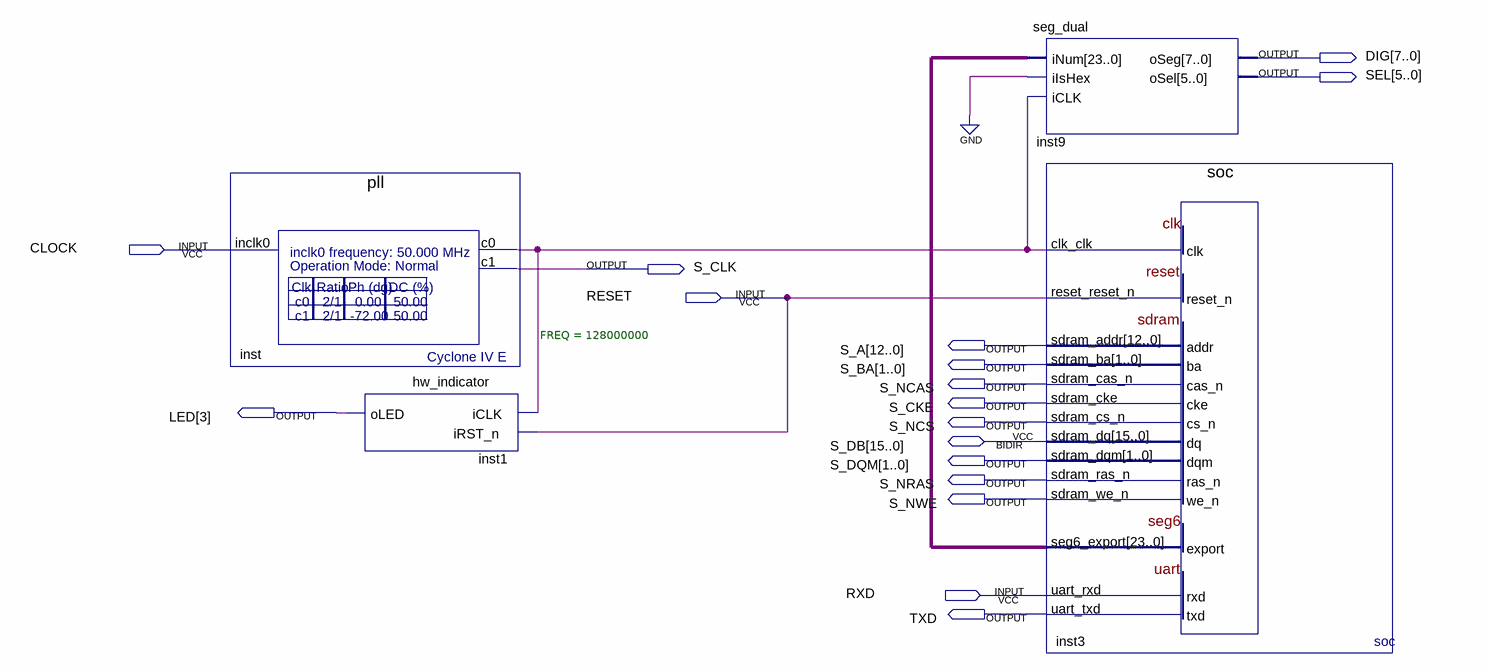
[diagram p0: schematic sheet]
// Quartus schematic top.bdf as structural Verilog: 4 symbols, 17 pins
module top (
  input  CLOCK,
  input  RESET,
  input  RXD,
  inout  [15:0] S_DB,
  output [7:0] DIG,
  output [5:0] SEL,
  output S_CLK,
  output [12:0] S_A,
  output [1:0] S_BA,
  output S_NCAS,
  output S_CKE,
  output [3:3] LED,
  output S_NCS,
  output [1:0] S_DQM,
  output S_NRAS,
  output S_NWE,
  output TXD
);

  wire inst_c0;
  wire [23:0] inst3_seg6_export;

  pll inst (.inclk0(CLOCK), .c0(inst_c0), .c1(S_CLK));
  hw_indicator #(.FREQ(128000000)) inst1 (.iCLK(inst_c0), .iRST_n(RESET), .oLED(LED[3]));
  seg_dual inst9 (.iNum(inst3_seg6_export), .iIsHex(1'b0), .iCLK(inst_c0), .oSeg(DIG), .oSel(SEL));
  soc inst3 (
    .clk_clk(inst_c0), .reset_reset_n(RESET), .uart_rxd(RXD), .sdram_addr(S_A), .sdram_ba(S_BA),
    .sdram_cas_n(S_NCAS), .sdram_cke(S_CKE), .sdram_cs_n(S_NCS), .sdram_dqm(S_DQM), .sdram_ras_n(S_NRAS),
    .sdram_we_n(S_NWE), .seg6_export(inst3_seg6_export), .uart_txd(TXD), .sdram_dq(S_DB));
endmodule
